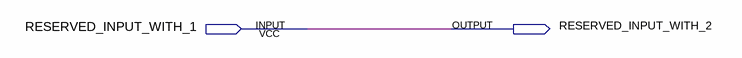
[diagram p0: schematic sheet]
// Quartus schematic test1.bdf as structural Verilog: 0 symbols, 2 pins
module test1 (
  input  RESERVED_INPUT_WITH_1,
  output RESERVED_INPUT_WITH_2
);


  assign RESERVED_INPUT_WITH_2 = RESERVED_INPUT_WITH_1;
endmodule
